# Altium schematic sheet connectors.SchDoc
size A3; Organization: Develer s.r.l.; Address1: via Mugellese 1/A; Address2: 50019 Campi Bisenzio; Address3: Firenze; Address4: ITALY; Revision: A; SheetNumber: 1; SheetTotal: 1
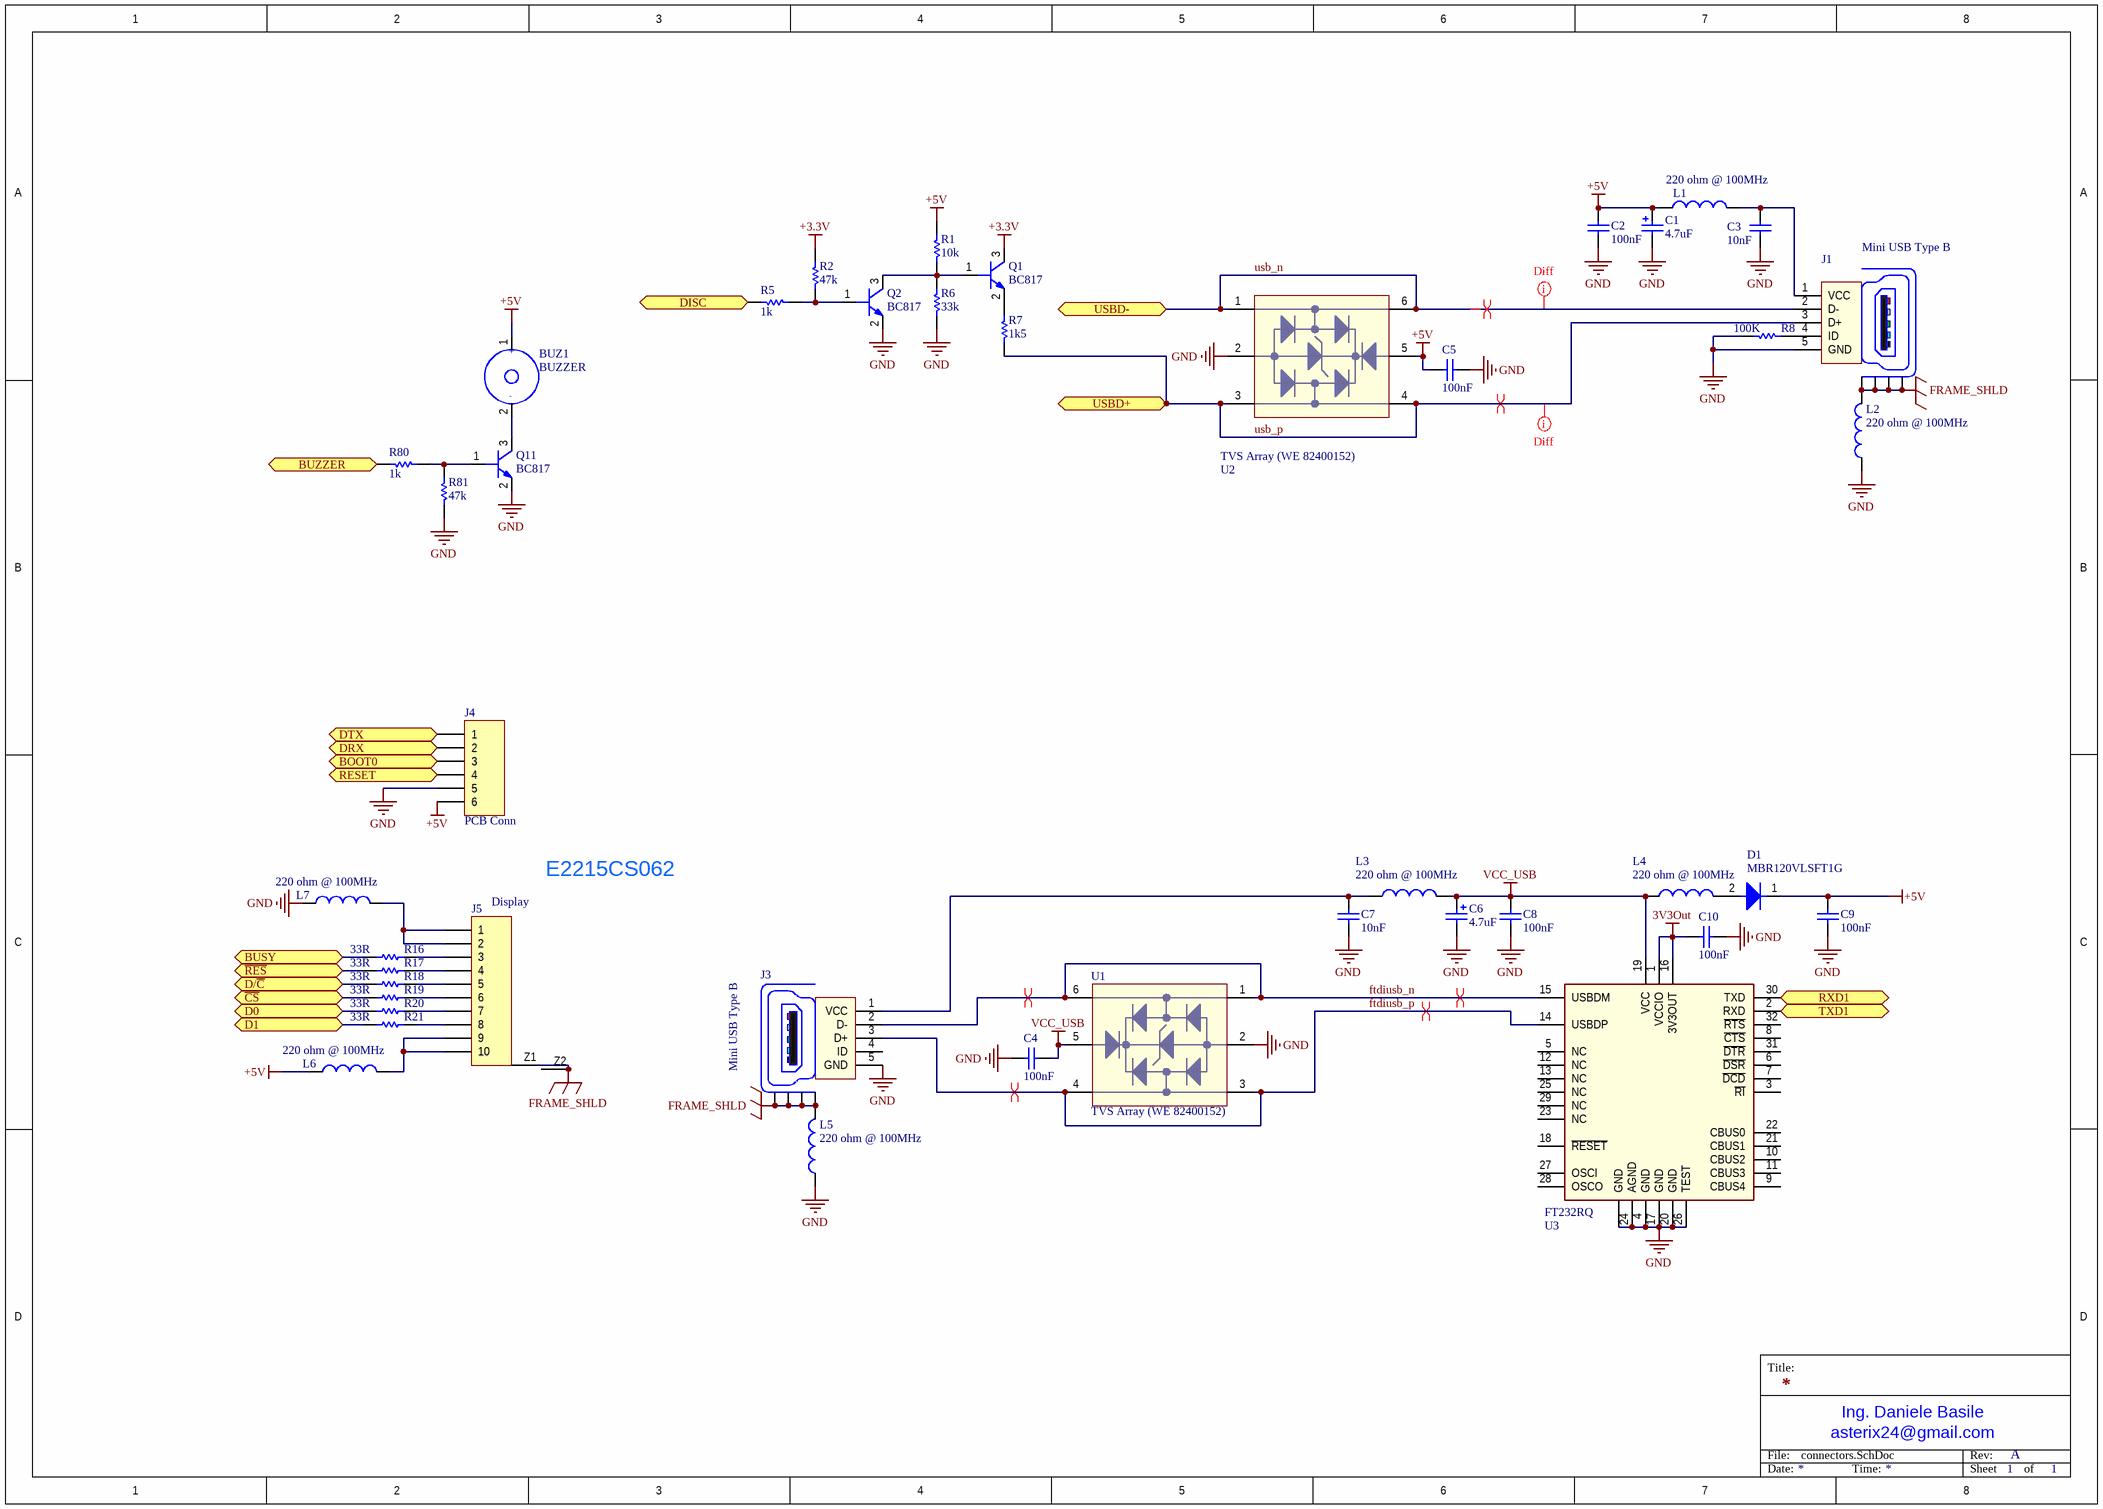
[diagram p0: connectors.SchDoc]

## Parts
BUZ1  BUZZER  [buzzer_14mm_thd]
C1  4.7uF  [1206_[3216]]
C2  100nF  [0603_[1608]]
C3  10nF  [0603_[1608]]
C4  100nF  [0603_[1608]]
C5  100nF  [0603_[1608]]
C6  4.7uF  [1206_[3216]]
C7  10nF  [0603_[1608]]
C8  100nF  [0603_[1608]]
C9  100nF  [0603_[1608]]
C10  100nF  [0603_[1608]]
D1  MBR120VLSFT1G  [SOD-123]
J1  Mini USB Type B  [usb_typeB_mini_smd]
J3  Mini USB Type B  [usb_typeB_mini_smd]
J4  PCB Conn  [HEADER_1X6_2.54MM_THD]
J5  Display  [fcc-zif_10pin_0.5mm]
L1  220 ohm @ 100MHz  [0805_[2012]]
L2  220 ohm @ 100MHz  [0805_[2012]]
L3  220 ohm @ 100MHz  [0805_[2012]]
L4  220 ohm @ 100MHz  [0805_[2012]]
L5  220 ohm @ 100MHz  [0805_[2012]]
L6  220 ohm @ 100MHz  [0805_[2012]]
L7  220 ohm @ 100MHz  [0805_[2012]]
Q1  BC817  [SOT-23]
Q2  BC817  [SOT-23]
Q11  BC817  [SOT-23]
R1  10k  [0603_[1608]]
R2  47k  [0603_[1608]]
R5  1k  [0603_[1608]]
R6  33k  [0603_[1608]]
R7  1k5  [0603_[1608]]
R8  100K  [0603_[1608]]
R16  33R  [0603_[1608]]
R17  33R  [0603_[1608]]
R18  33R  [0603_[1608]]
R19  33R  [0603_[1608]]
R20  33R  [0603_[1608]]
R21  33R  [0603_[1608]]
R80  1k  [0603_[1608]]
R81  47k  [0603_[1608]]
U1  TVS Array (WE 82400152)  [SOT-563]
U2  TVS Array (WE 82400152)  [SOT-563]
U3  FT232RQ  [QFN-32]

## Ports
BOOT0, BUSY, BUZZER, D0, D1, D/~{C}, DISC, DRX, DTX, RESET, RXD1, TXD1, USBD+, USBD-, ~{CS}, ~{RES}

## Nets
3V3Out: C10.1 U3.1(VCCIO) U3.16(3V3OUT)
+3.3V: Q1.3(C) R2.1
+5V: BUZ1.1 C1.1 C2.1 C5.2 C9.2 D1.1(K) J4.6 L1.1 L6.1 R1.1 U2.5
FRAME_SHLD: J1.Z1(Shield) J1.Z2(Shield) J1.Z3(Shield) J1.Z4(Shield) J3.Z1(Shield) J3.Z2(Shield) J3.Z3(Shield) J3.Z4(Shield) J5.Z1 J5.Z2 L2.2 L5.2
GND: C1.2 C2.2 C3.2 C4.1 C5.1 C6.2 C7.2 C8.2 C9.1 C10.2 J1.5(GND) J3.5(GND) J4.5 L2.1 L5.1 L7.1 Q2.2(E) Q11.2(E) R6.2 R8.2 R81.2 U1.2 U2.2 U3.4(GND) U3.17(GND) U3.20(GND) U3.24(AGND) U3.26(TEST) U3.GND_PAD(GND)
VCC_USB: C4.2 C6.1 C8.1 L3.1 L4.2 U1.5 U3.19(VCC)
BOOT0: J4.3 ; port BOOT0
BUSY: R16.2 ; port BUSY
BUZZER: R80.2 ; port BUZZER
~{CS}: R19.2 ; port ~{CS}
D0: R20.2 ; port D0
D1: R21.2 ; port D1
D/~{C}: R18.2 ; port D/~{C}
DISC: R5.2 ; port DISC
DRX: J4.2 ; port DRX
DTX: J4.1 ; port DTX
ftdiusb_n: J3.2(D-) U1.1 U1.6 U3.15(USBDM)
ftdiusb_p: J3.3(D+) U1.3 U1.4 U3.14(USBDP)
~{RES}: R17.2 ; port ~{RES}
RESET: J4.4 ; port RESET
RXD1: U3.30(TXD) ; port RXD1
TXD1: U3.2(RXD) ; port TXD1
usb_n: J1.2(D-) U2.1 U2.6 ; port USBD-
usb_p: J1.3(D+) R7.2 U2.3 U2.4 ; port USBD+
NetBUZ1_2: BUZ1.2 Q11.3(C)
NetC3_1: C3.1 J1.1(VCC) L1.2
NetC7_1: C7.1 J3.1(VCC) L3.2
NetD1_2: D1.2(A) L4.1
NetJ1_4: J1.4(ID) R8.1
NetJ5_1: J5.1 J5.2 L7.2
NetJ5_3: J5.3 R16.1
NetJ5_4: J5.4 R17.1
NetJ5_5: J5.5 R18.1
NetJ5_6: J5.6 R19.1
NetJ5_7: J5.7 R20.1
NetJ5_8: J5.8 R21.1
NetJ5_9: J5.9 J5.10 L6.2
NetQ1_1: Q1.1(B) Q2.3(C) R1.2 R6.1
NetQ1_2: Q1.2(E) R7.1
NetQ2_1: Q2.1(B) R2.2 R5.1
NetQ11_1: Q11.1(B) R80.1 R81.1

Not connected (* = marked no-connect by the designer): J3 4(ID); U3 3(~{RI}) 5(NC) 6(~{DSR}) 7(~{DCD}) 8(~{CTS}) 9(CBUS4) 10(CBUS2) 11(CBUS3) 12(NC) 13(NC) 18(~{RESET}) 21(CBUS1) 22(CBUS0) 23(NC) 25(NC) 27(OSCI) 28(OSCO) 29(NC) 31(~{DTR}) 32(~{RTS})

## Layout directives
net class usb_diff: usb_n, usb_p
differential pair: ftdiusb_n, ftdiusb_p, usb_n, usb_p

## Notes on the sheet
- (near J5) E2215CS062
- Title:
- File:
- asterix24@gmail.com
- Ing. Daniele Basile
- Rev:
- Date:
- Time:
- Sheet
- of
- (in symbol BUZZER) +; -

## Library data of the parts
C1 = Cap Pol1: Ceramic X7R 16V; Value: 10uF; Published: 8-Jun-2000; Revision: July-2002: Re-released for DXP Platform.; Publisher: Altium Limited
C2 C8-C10 = Cap: Ceramic X7R 50V; Value: 10nF; Published: 8-Jun-2000; Revision: July-2002: Re-released for DXP Platform.; Publisher: Altium Limited
C3 C7 = Cap: Ceramic X7R 50V; Published: 8-Jun-2000; Revision: July-2002: Re-released for DXP Platform.; Publisher: Altium Limited; Value: 10nF
C4 C5 = Cap: Ceramic X7R 50V; Value: 100pF; Published: 8-Jun-2000; LatestRevisionDate: 17-Jul-2002; LatestRevisionNote: Re-released for DXP Platform.; PackageReference: RAD-0.3; Publisher: Altium Limited; PackageDescription: Radial Cap, Thru-Hole; 2 Leads; 0.3 in Pin Spacing
C6 = Cap Pol1: Ceramic X5R 25V; Value: 10uF; Published: 8-Jun-2000; Revision: July-2002: Re-released for DXP Platform.; Publisher: Altium Limited
D1 = Diode: Diode Schottky  low Vf, If 1A (PMEG3010ER; MBRX120LF)
J1 = USB_Con_Type_B_mini_SMT: Mini USB SMT Type B 5 Contacts; Manufacturer: Würth Elektronik eiSos GmbH; partNo: 65100516121; ComponentLink1 Description: Manufacturer; ComponentLink2 Description: Datasheet; NoPins: 5; ComponentLink1URL: http://www.we-online.de; ComponentLink2URL: http://katalog.we-online.de/em/datasheet/65100516121.pdf; Created by: Karrer Zheng; Created Date: 10/10/2014
J3 = USB_Con_Type_B_mini_SMT: Mini USB SMT Type B 5 Contacts (WE 65100516121); Manufacturer: Würth Elektronik eiSos GmbH; ComponentLink1 Description: Manufacturer; ComponentLink2 Description: Datasheet; NoPins: 5; ComponentLink1URL: http://www.we-online.de; ComponentLink2URL: http://katalog.we-online.de/em/datasheet/65100516121.pdf; Created by: Karrer Zheng; Created Date: 10/10/2014; partNo: 65100516121
J4 = Header 6: Pin Header, 1x6, 2.54mm.; LatestRevisionDate: 17-Jul-2002; LatestRevisionNote: Re-released for DXP Platform.; Publisher: Altium Limited
J5 = Header 10: LatestRevisionDate: 17-Jul-2002; LatestRevisionNote: Re-released for DXP Platform.; Publisher: Altium Limited
L1-L7 = Inductor: WE 742792022
Q1 Q2 Q11 = BC817: BJT NPN
R1 R2 R6 R7 R16-R21 R81 = Res1: Resistor; Value: 1K; Published: 8-Jun-2000; Revision: July-2002: Re-released for DXP Platform.; Publisher: Altium Limited
R5 R80 = Res1: Resistor; Published: 8-Jun-2000; Revision: July-2002: Re-released for DXP Platform.; Publisher: Altium Limited; Value: 1K
R8 = Resistor_ST: Resistor; Value: 10K
U1 U2 = TVS_Diode_Array
U3 = FT232RQ: Serial TTL 232 <-> USB (QFN-32)